# Altium schematic sheet LEDs.SchDoc
size 254 x 243 mm; SheetNumber: 1; SheetTotal: 2
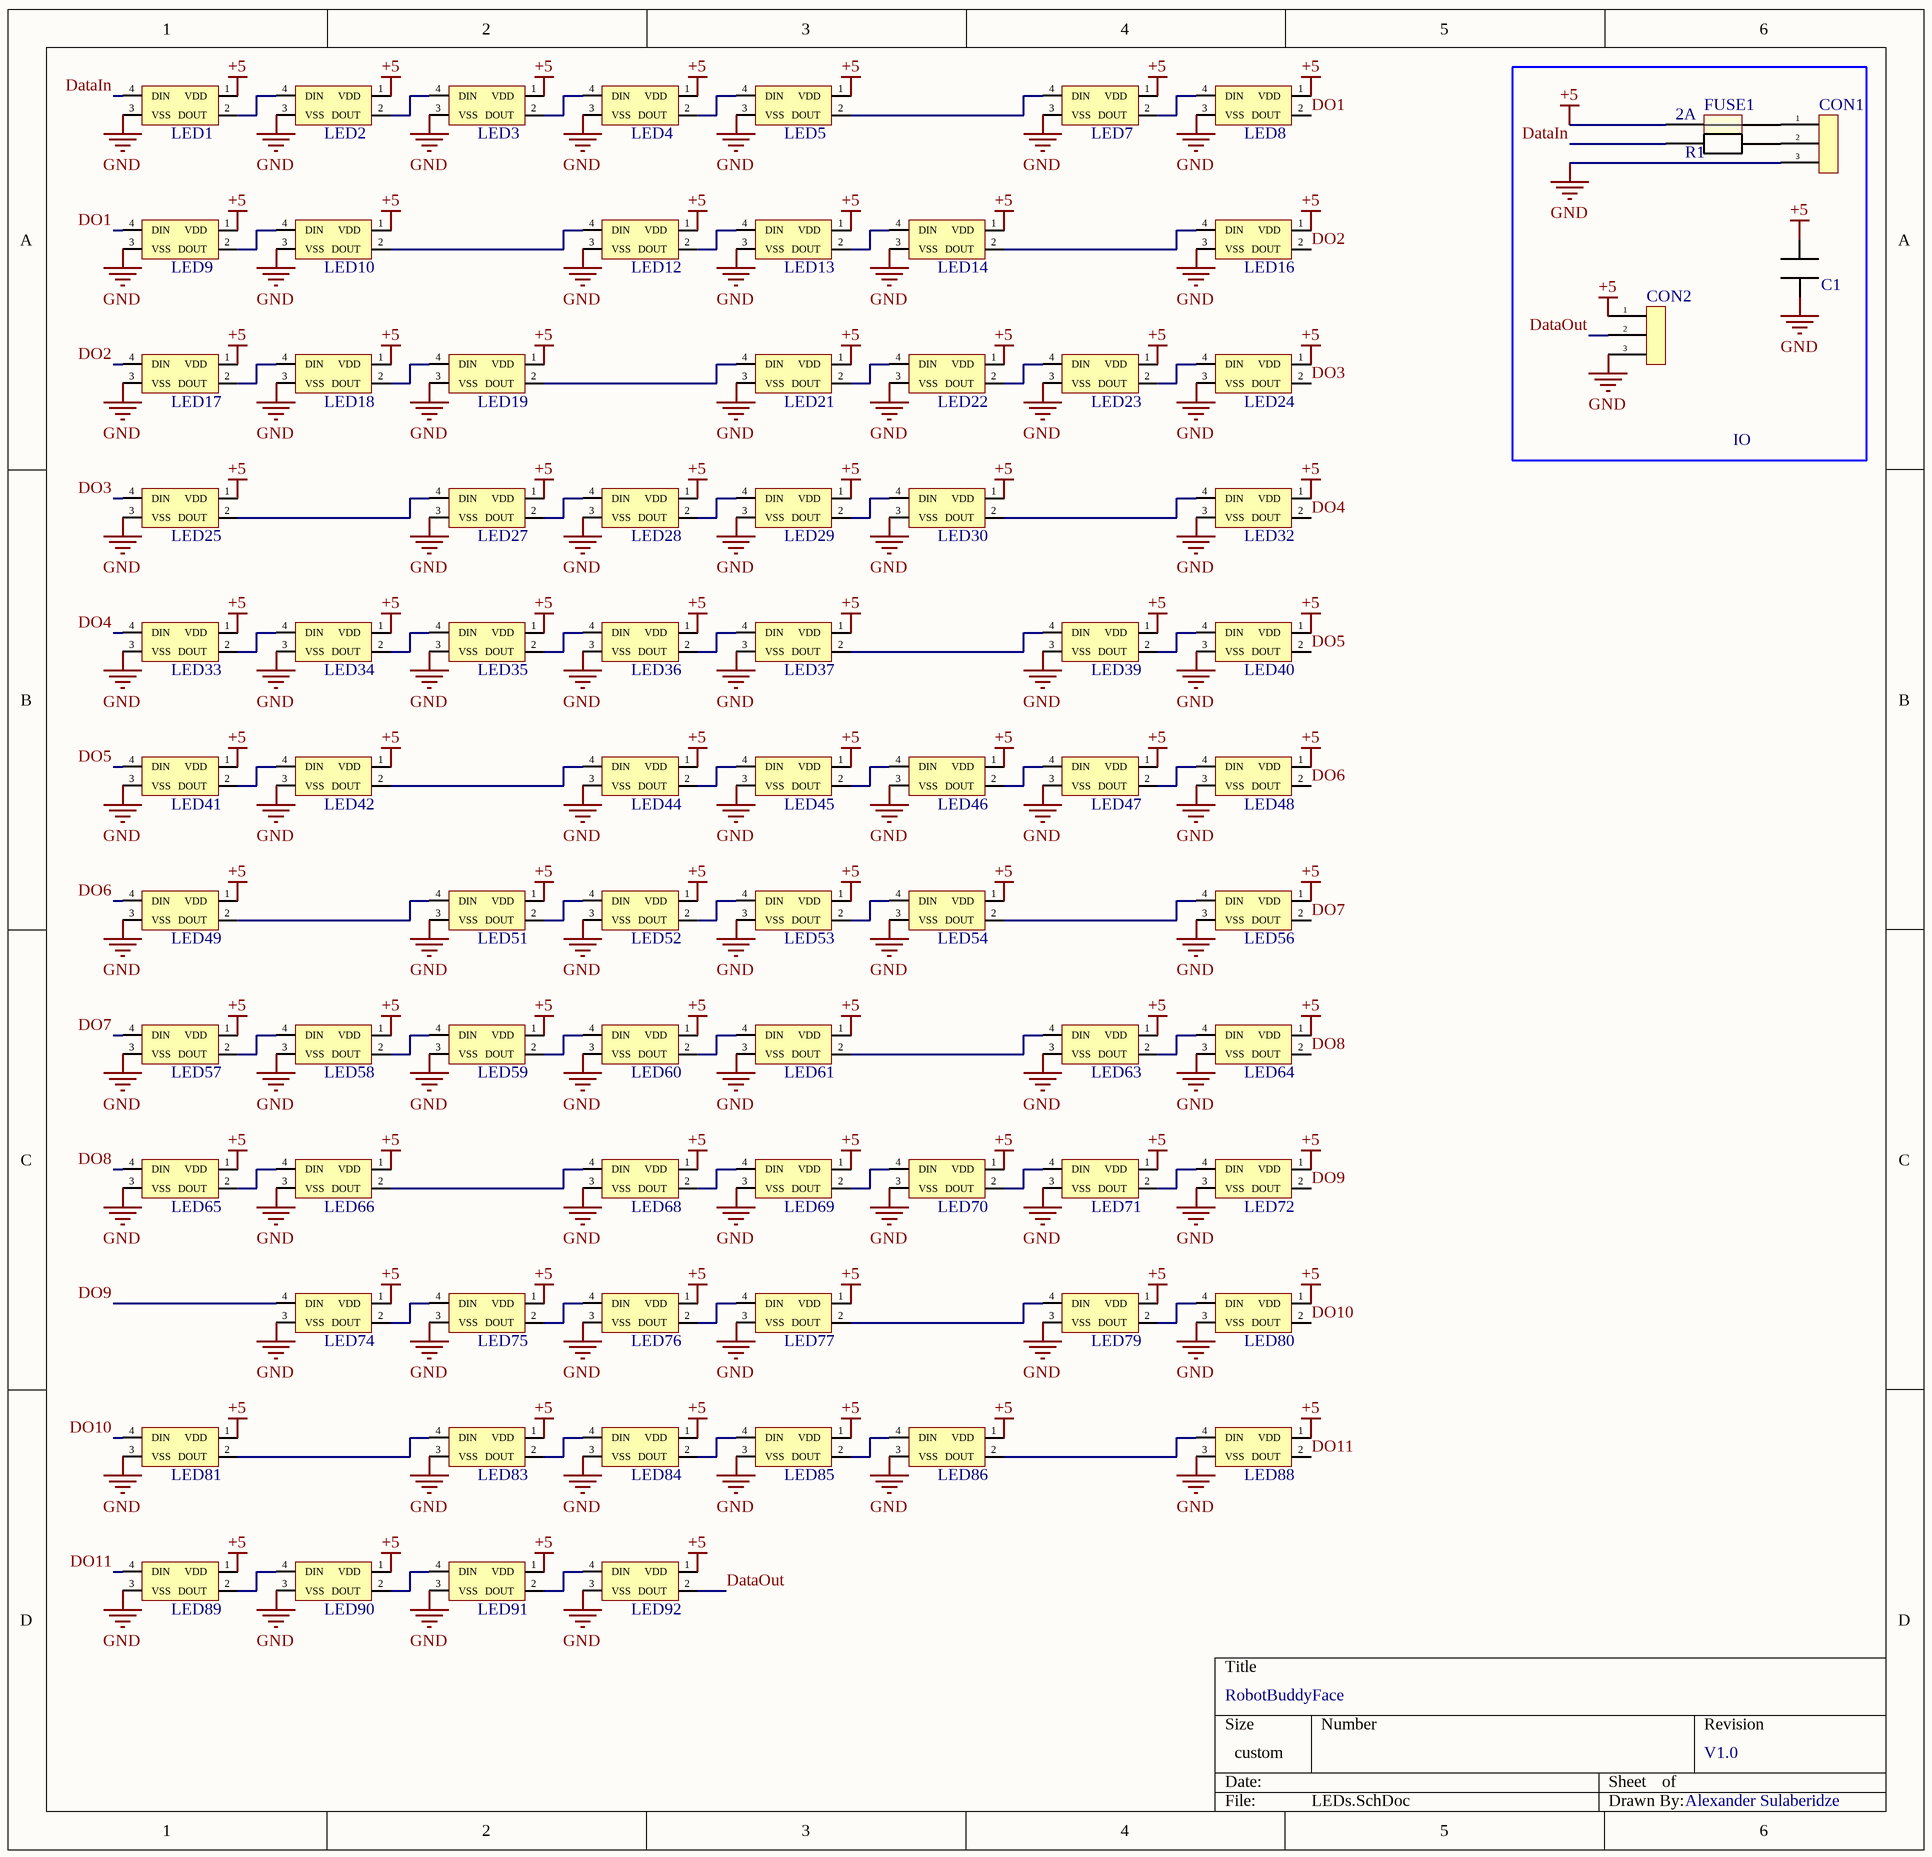
[diagram p0: LEDs.SchDoc]

## Parts
C1  47uF 10V  [CAP_1206]  (value not drawn)
CON1  HX-XH2.54-3PZZ  [JST XH2.54mm 1x3]  (value not drawn)
CON2  HX-XH2.54-3PZZ  [JST XH2.54mm 1x3]  (value not drawn)
FUSE1  2A  [FUSE_1206]
LED1  Worldsemi WS2812B-B/W  [SMD5050 - WS2812B-B]  (value not drawn)
LED2  Worldsemi WS2812B-B/W  [SMD5050 - WS2812B-B]  (value not drawn)
LED3  Worldsemi WS2812B-B/W  [SMD5050 - WS2812B-B]  (value not drawn)
LED4  Worldsemi WS2812B-B/W  [SMD5050 - WS2812B-B]  (value not drawn)
LED5  Worldsemi WS2812B-B/W  [SMD5050 - WS2812B-B]  (value not drawn)
LED7  Worldsemi WS2812B-B/W  [SMD5050 - WS2812B-B]  (value not drawn)
LED8  Worldsemi WS2812B-B/W  [SMD5050 - WS2812B-B]  (value not drawn)
LED9  Worldsemi WS2812B-B/W  [SMD5050 - WS2812B-B]  (value not drawn)
LED10  Worldsemi WS2812B-B/W  [SMD5050 - WS2812B-B]  (value not drawn)
LED12  Worldsemi WS2812B-B/W  [SMD5050 - WS2812B-B]  (value not drawn)
LED13  Worldsemi WS2812B-B/W  [SMD5050 - WS2812B-B]  (value not drawn)
LED14  Worldsemi WS2812B-B/W  [SMD5050 - WS2812B-B]  (value not drawn)
LED16  Worldsemi WS2812B-B/W  [SMD5050 - WS2812B-B]  (value not drawn)
LED17  Worldsemi WS2812B-B/W  [SMD5050 - WS2812B-B]  (value not drawn)
LED18  Worldsemi WS2812B-B/W  [SMD5050 - WS2812B-B]  (value not drawn)
LED19  Worldsemi WS2812B-B/W  [SMD5050 - WS2812B-B]  (value not drawn)
LED21  Worldsemi WS2812B-B/W  [SMD5050 - WS2812B-B]  (value not drawn)
LED22  Worldsemi WS2812B-B/W  [SMD5050 - WS2812B-B]  (value not drawn)
LED23  Worldsemi WS2812B-B/W  [SMD5050 - WS2812B-B]  (value not drawn)
LED24  Worldsemi WS2812B-B/W  [SMD5050 - WS2812B-B]  (value not drawn)
LED25  Worldsemi WS2812B-B/W  [SMD5050 - WS2812B-B]  (value not drawn)
LED27  Worldsemi WS2812B-B/W  [SMD5050 - WS2812B-B]  (value not drawn)
LED28  Worldsemi WS2812B-B/W  [SMD5050 - WS2812B-B]  (value not drawn)
LED29  Worldsemi WS2812B-B/W  [SMD5050 - WS2812B-B]  (value not drawn)
LED30  Worldsemi WS2812B-B/W  [SMD5050 - WS2812B-B]  (value not drawn)
LED32  Worldsemi WS2812B-B/W  [SMD5050 - WS2812B-B]  (value not drawn)
LED33  Worldsemi WS2812B-B/W  [SMD5050 - WS2812B-B]  (value not drawn)
LED34  Worldsemi WS2812B-B/W  [SMD5050 - WS2812B-B]  (value not drawn)
LED35  Worldsemi WS2812B-B/W  [SMD5050 - WS2812B-B]  (value not drawn)
LED36  Worldsemi WS2812B-B/W  [SMD5050 - WS2812B-B]  (value not drawn)
LED37  Worldsemi WS2812B-B/W  [SMD5050 - WS2812B-B]  (value not drawn)
LED39  Worldsemi WS2812B-B/W  [SMD5050 - WS2812B-B]  (value not drawn)
LED40  Worldsemi WS2812B-B/W  [SMD5050 - WS2812B-B]  (value not drawn)
LED41  Worldsemi WS2812B-B/W  [SMD5050 - WS2812B-B]  (value not drawn)
LED42  Worldsemi WS2812B-B/W  [SMD5050 - WS2812B-B]  (value not drawn)
LED44  Worldsemi WS2812B-B/W  [SMD5050 - WS2812B-B]  (value not drawn)
LED45  Worldsemi WS2812B-B/W  [SMD5050 - WS2812B-B]  (value not drawn)
LED46  Worldsemi WS2812B-B/W  [SMD5050 - WS2812B-B]  (value not drawn)
LED47  Worldsemi WS2812B-B/W  [SMD5050 - WS2812B-B]  (value not drawn)
LED48  Worldsemi WS2812B-B/W  [SMD5050 - WS2812B-B]  (value not drawn)
LED49  Worldsemi WS2812B-B/W  [SMD5050 - WS2812B-B]  (value not drawn)
LED51  Worldsemi WS2812B-B/W  [SMD5050 - WS2812B-B]  (value not drawn)
LED52  Worldsemi WS2812B-B/W  [SMD5050 - WS2812B-B]  (value not drawn)
LED53  Worldsemi WS2812B-B/W  [SMD5050 - WS2812B-B]  (value not drawn)
LED54  Worldsemi WS2812B-B/W  [SMD5050 - WS2812B-B]  (value not drawn)
LED56  Worldsemi WS2812B-B/W  [SMD5050 - WS2812B-B]  (value not drawn)
LED57  Worldsemi WS2812B-B/W  [SMD5050 - WS2812B-B]  (value not drawn)
LED58  Worldsemi WS2812B-B/W  [SMD5050 - WS2812B-B]  (value not drawn)
LED59  Worldsemi WS2812B-B/W  [SMD5050 - WS2812B-B]  (value not drawn)
LED60  Worldsemi WS2812B-B/W  [SMD5050 - WS2812B-B]  (value not drawn)
LED61  Worldsemi WS2812B-B/W  [SMD5050 - WS2812B-B]  (value not drawn)
LED63  Worldsemi WS2812B-B/W  [SMD5050 - WS2812B-B]  (value not drawn)
LED64  Worldsemi WS2812B-B/W  [SMD5050 - WS2812B-B]  (value not drawn)
LED65  Worldsemi WS2812B-B/W  [SMD5050 - WS2812B-B]  (value not drawn)
LED66  Worldsemi WS2812B-B/W  [SMD5050 - WS2812B-B]  (value not drawn)
LED68  Worldsemi WS2812B-B/W  [SMD5050 - WS2812B-B]  (value not drawn)
LED69  Worldsemi WS2812B-B/W  [SMD5050 - WS2812B-B]  (value not drawn)
LED70  Worldsemi WS2812B-B/W  [SMD5050 - WS2812B-B]  (value not drawn)
LED71  Worldsemi WS2812B-B/W  [SMD5050 - WS2812B-B]  (value not drawn)
LED72  Worldsemi WS2812B-B/W  [SMD5050 - WS2812B-B]  (value not drawn)
LED74  Worldsemi WS2812B-B/W  [SMD5050 - WS2812B-B]  (value not drawn)
LED75  Worldsemi WS2812B-B/W  [SMD5050 - WS2812B-B]  (value not drawn)
LED76  Worldsemi WS2812B-B/W  [SMD5050 - WS2812B-B]  (value not drawn)
LED77  Worldsemi WS2812B-B/W  [SMD5050 - WS2812B-B]  (value not drawn)
LED79  Worldsemi WS2812B-B/W  [SMD5050 - WS2812B-B]  (value not drawn)
LED80  Worldsemi WS2812B-B/W  [SMD5050 - WS2812B-B]  (value not drawn)
LED81  Worldsemi WS2812B-B/W  [SMD5050 - WS2812B-B]  (value not drawn)
LED83  Worldsemi WS2812B-B/W  [SMD5050 - WS2812B-B]  (value not drawn)
LED84  Worldsemi WS2812B-B/W  [SMD5050 - WS2812B-B]  (value not drawn)
LED85  Worldsemi WS2812B-B/W  [SMD5050 - WS2812B-B]  (value not drawn)
LED86  Worldsemi WS2812B-B/W  [SMD5050 - WS2812B-B]  (value not drawn)
LED88  Worldsemi WS2812B-B/W  [SMD5050 - WS2812B-B]  (value not drawn)
LED89  Worldsemi WS2812B-B/W  [SMD5050 - WS2812B-B]  (value not drawn)
LED90  Worldsemi WS2812B-B/W  [SMD5050 - WS2812B-B]  (value not drawn)
LED91  Worldsemi WS2812B-B/W  [SMD5050 - WS2812B-B]  (value not drawn)
LED92  Worldsemi WS2812B-B/W  [SMD5050 - WS2812B-B]  (value not drawn)
R1  500  [RES_0805]  (value not drawn)

## Blocks framed on the sheet
IO: C1 CON1 CON2 FUSE1 R1

## Nets
+5: C1.2 CON2.1 FUSE1.1 LED1.1(VDD) LED2.1(VDD) LED3.1(VDD) LED4.1(VDD) LED5.1(VDD) LED7.1(VDD) LED8.1(VDD) LED9.1(VDD) LED10.1(VDD) LED12.1(VDD) LED13.1(VDD) LED14.1(VDD) LED16.1(VDD) LED17.1(VDD) LED18.1(VDD) LED19.1(VDD) LED21.1(VDD) LED22.1(VDD) LED23.1(VDD) LED24.1(VDD) LED25.1(VDD) LED27.1(VDD) LED28.1(VDD) LED29.1(VDD) LED30.1(VDD) LED32.1(VDD) LED33.1(VDD) LED34.1(VDD) LED35.1(VDD) LED36.1(VDD) LED37.1(VDD) LED39.1(VDD) LED40.1(VDD) LED41.1(VDD) LED42.1(VDD) LED44.1(VDD) LED45.1(VDD) LED46.1(VDD) LED47.1(VDD) LED48.1(VDD) LED49.1(VDD) LED51.1(VDD) LED52.1(VDD) LED53.1(VDD) LED54.1(VDD) LED56.1(VDD) LED57.1(VDD) LED58.1(VDD) LED59.1(VDD) LED60.1(VDD) LED61.1(VDD) LED63.1(VDD) LED64.1(VDD) LED65.1(VDD) LED66.1(VDD) LED68.1(VDD) LED69.1(VDD) LED70.1(VDD) LED71.1(VDD) LED72.1(VDD) LED74.1(VDD) LED75.1(VDD) LED76.1(VDD) LED77.1(VDD) LED79.1(VDD) LED80.1(VDD) LED81.1(VDD) LED83.1(VDD) LED84.1(VDD) LED85.1(VDD) LED86.1(VDD) LED88.1(VDD) LED89.1(VDD) LED90.1(VDD) LED91.1(VDD) LED92.1(VDD)
GND: C1.1 CON1.3 CON2.3 LED1.3(VSS) LED2.3(VSS) LED3.3(VSS) LED4.3(VSS) LED5.3(VSS) LED7.3(VSS) LED8.3(VSS) LED9.3(VSS) LED10.3(VSS) LED12.3(VSS) LED13.3(VSS) LED14.3(VSS) LED16.3(VSS) LED17.3(VSS) LED18.3(VSS) LED19.3(VSS) LED21.3(VSS) LED22.3(VSS) LED23.3(VSS) LED24.3(VSS) LED25.3(VSS) LED27.3(VSS) LED28.3(VSS) LED29.3(VSS) LED30.3(VSS) LED32.3(VSS) LED33.3(VSS) LED34.3(VSS) LED35.3(VSS) LED36.3(VSS) LED37.3(VSS) LED39.3(VSS) LED40.3(VSS) LED41.3(VSS) LED42.3(VSS) LED44.3(VSS) LED45.3(VSS) LED46.3(VSS) LED47.3(VSS) LED48.3(VSS) LED49.3(VSS) LED51.3(VSS) LED52.3(VSS) LED53.3(VSS) LED54.3(VSS) LED56.3(VSS) LED57.3(VSS) LED58.3(VSS) LED59.3(VSS) LED60.3(VSS) LED61.3(VSS) LED63.3(VSS) LED64.3(VSS) LED65.3(VSS) LED66.3(VSS) LED68.3(VSS) LED69.3(VSS) LED70.3(VSS) LED71.3(VSS) LED72.3(VSS) LED74.3(VSS) LED75.3(VSS) LED76.3(VSS) LED77.3(VSS) LED79.3(VSS) LED80.3(VSS) LED81.3(VSS) LED83.3(VSS) LED84.3(VSS) LED85.3(VSS) LED86.3(VSS) LED88.3(VSS) LED89.3(VSS) LED90.3(VSS) LED91.3(VSS) LED92.3(VSS)
DataIn: LED1.4(DIN) R1.1
DataOut: CON2.2 LED92.2(DOUT)
DO1: LED8.2(DOUT) LED9.4(DIN)
DO2: LED16.2(DOUT) LED17.4(DIN)
DO3: LED24.2(DOUT) LED25.4(DIN)
DO4: LED32.2(DOUT) LED33.4(DIN)
DO5: LED40.2(DOUT) LED41.4(DIN)
DO6: LED48.2(DOUT) LED49.4(DIN)
DO7: LED56.2(DOUT) LED57.4(DIN)
DO8: LED64.2(DOUT) LED65.4(DIN)
DO9: LED72.2(DOUT) LED74.4(DIN)
DO10: LED80.2(DOUT) LED81.4(DIN)
DO11: LED88.2(DOUT) LED89.4(DIN)
NetCON1_1: CON1.1 FUSE1.2
NetCON1_2: CON1.2 R1.2
NetLED1_2: LED1.2(DOUT) LED2.4(DIN)
NetLED2_2: LED2.2(DOUT) LED3.4(DIN)
NetLED3_2: LED3.2(DOUT) LED4.4(DIN)
NetLED4_2: LED4.2(DOUT) LED5.4(DIN)
NetLED5_2: LED5.2(DOUT) LED7.4(DIN)
NetLED7_2: LED7.2(DOUT) LED8.4(DIN)
NetLED9_2: LED9.2(DOUT) LED10.4(DIN)
NetLED10_2: LED10.2(DOUT) LED12.4(DIN)
NetLED12_2: LED12.2(DOUT) LED13.4(DIN)
NetLED13_2: LED13.2(DOUT) LED14.4(DIN)
NetLED14_2: LED14.2(DOUT) LED16.4(DIN)
NetLED17_2: LED17.2(DOUT) LED18.4(DIN)
NetLED18_2: LED18.2(DOUT) LED19.4(DIN)
NetLED19_2: LED19.2(DOUT) LED21.4(DIN)
NetLED21_2: LED21.2(DOUT) LED22.4(DIN)
NetLED22_2: LED22.2(DOUT) LED23.4(DIN)
NetLED23_2: LED23.2(DOUT) LED24.4(DIN)
NetLED25_2: LED25.2(DOUT) LED27.4(DIN)
NetLED27_2: LED27.2(DOUT) LED28.4(DIN)
NetLED28_2: LED28.2(DOUT) LED29.4(DIN)
NetLED29_2: LED29.2(DOUT) LED30.4(DIN)
NetLED30_2: LED30.2(DOUT) LED32.4(DIN)
NetLED33_2: LED33.2(DOUT) LED34.4(DIN)
NetLED34_2: LED34.2(DOUT) LED35.4(DIN)
NetLED35_2: LED35.2(DOUT) LED36.4(DIN)
NetLED36_2: LED36.2(DOUT) LED37.4(DIN)
NetLED37_2: LED37.2(DOUT) LED39.4(DIN)
NetLED39_2: LED39.2(DOUT) LED40.4(DIN)
NetLED41_2: LED41.2(DOUT) LED42.4(DIN)
NetLED42_2: LED42.2(DOUT) LED44.4(DIN)
NetLED44_2: LED44.2(DOUT) LED45.4(DIN)
NetLED45_2: LED45.2(DOUT) LED46.4(DIN)
NetLED46_2: LED46.2(DOUT) LED47.4(DIN)
NetLED47_2: LED47.2(DOUT) LED48.4(DIN)
NetLED49_2: LED49.2(DOUT) LED51.4(DIN)
NetLED51_2: LED51.2(DOUT) LED52.4(DIN)
NetLED52_2: LED52.2(DOUT) LED53.4(DIN)
NetLED53_2: LED53.2(DOUT) LED54.4(DIN)
NetLED54_2: LED54.2(DOUT) LED56.4(DIN)
NetLED57_2: LED57.2(DOUT) LED58.4(DIN)
NetLED58_2: LED58.2(DOUT) LED59.4(DIN)
NetLED59_2: LED59.2(DOUT) LED60.4(DIN)
NetLED60_2: LED60.2(DOUT) LED61.4(DIN)
NetLED61_2: LED61.2(DOUT) LED63.4(DIN)
NetLED63_2: LED63.2(DOUT) LED64.4(DIN)
NetLED65_2: LED65.2(DOUT) LED66.4(DIN)
NetLED66_2: LED66.2(DOUT) LED68.4(DIN)
NetLED68_2: LED68.2(DOUT) LED69.4(DIN)
NetLED69_2: LED69.2(DOUT) LED70.4(DIN)
NetLED70_2: LED70.2(DOUT) LED71.4(DIN)
NetLED71_2: LED71.2(DOUT) LED72.4(DIN)
NetLED74_2: LED74.2(DOUT) LED75.4(DIN)
NetLED75_2: LED75.2(DOUT) LED76.4(DIN)
NetLED76_2: LED76.2(DOUT) LED77.4(DIN)
NetLED77_2: LED77.2(DOUT) LED79.4(DIN)
NetLED79_2: LED79.2(DOUT) LED80.4(DIN)
NetLED81_2: LED81.2(DOUT) LED83.4(DIN)
NetLED83_2: LED83.2(DOUT) LED84.4(DIN)
NetLED84_2: LED84.2(DOUT) LED85.4(DIN)
NetLED85_2: LED85.2(DOUT) LED86.4(DIN)
NetLED86_2: LED86.2(DOUT) LED88.4(DIN)
NetLED89_2: LED89.2(DOUT) LED90.4(DIN)
NetLED90_2: LED90.2(DOUT) LED91.4(DIN)
NetLED91_2: LED91.2(DOUT) LED92.4(DIN)

## Notes on the sheet
- RobotBuddyFace
- V1.0
- Alexander Sulaberidze

## Library data of the parts
C1 = CAP_1206: note: any manufacturer; val: 47uF 10V; sample link: https://www.lcsc.com/product-detail/C178332.html?spm=wm.fly.bg.5.xh___wm.fly.tp.3.ml&lcsc_vid=FFFZU1cHTlNeU1AHFQIIVgUAFgNWV1cEFVMNBl0AEgcxVlNeR1RZVVJUQVJaUTsOAxUeFF5JWBYZEEoKFBINSQcJGk4NBhADEA4cHktXRlVeSQwSGg0%3D
CON1 CON2 = JST XH2.54mm 1x3: Connector Header 3 position 2.54mm Pitch 3A Through Hole -25℃~+85℃; note: any manufacturer; sample link: https://www.lcsc.com/product-detail/C42391661.html?spm=wm.fly.bg.3.stp___wm.sxq.ssx.spl&lcsc_vid=FVFdBVUFR1ULBQFWR1cKXlxXQwQPVFVUQFJaUFIARFkxVlNRT1lcU11RQ1ZeUTtW; val: HX-XH2.54-3PZZ; unit price: $ 0.0102
FUSE1 = Fuse_1206: val: 2A; sample link: https://www.lcsc.com/product-detail/C2685749.html?s_z=n_q_t_ptc%2520fuse&spm=wm.fly.bg.0.xh___wm.ssy.tc.0.tz&lcsc_vid=FFFZU1cHTlNeU1AHFQIIVgUAFgNWV1cEFVMNBl0AEgcxVlNeR1RZVlxRRVZfUTsOAxUeFF5JWBYZEEoKFBINSQcJGk4eFQsCAgIaSgADAwAHC0slRVheX1JXRU8GEwkK
LED1-LED5 LED7-LED10 LED12-LED14 LED16-LED19 LED21-LED25 LED27-LED30 LED32-LED37 LED39-LED42 LED44-LED49 LED51-LED54 LED56-LED61 LED63-LED66 LED68-LED72 LED74-LED77 LED79-LED81 LED83-LED86 LED88-LED92 = Worldsemi WS2812B-B/W: Intelligent control LED integrated light source; val: Worldsemi WS2812B-B/W; note: *; sample link: https://www.lcsc.com/product-detail/C114586.html?s_z=s_undefined_t_WS2812B&spm=wm.fly.bg.0.xh___wm.ssy.tc.1.tz&lcsc_vid=RAULBAcCRwJfVQVVFgVdUgVREQNXXlAEEwRbVVBTRAAxVlNeR1RZVlRVQFhbVTsOAxUeFF5JWBYZEEoKFBINSQcJGk4eFQsCAgIaSgADAwAHC0slQ1NdXlFXTlNADxALGw%3D%3D; price: $ 0.0981
R1 = RES_0805: note: any manufacturer; val: 500